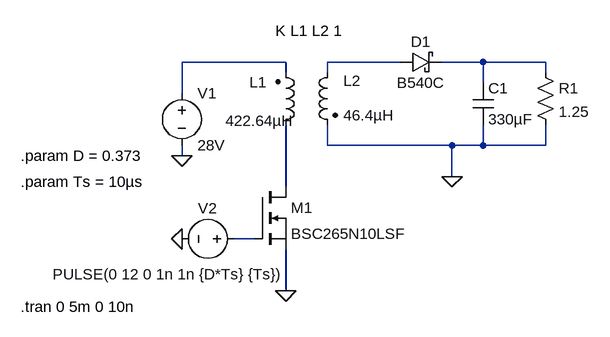
[diagram p0: schematic Flyback_Converter_1st_Draft.asc]
Flyback_Converter_1st_Draft.asc, the LTspice schematic file:
Version 4
SHEET 1 880 680
WIRE 160 64 0 64
WIRE 336 64 224 64
WIRE 464 64 400 64
WIRE 560 64 464 64
WIRE 160 80 160 64
WIRE 224 80 224 64
WIRE 560 80 560 64
WIRE 464 96 464 64
WIRE 0 112 0 64
WIRE 224 192 224 160
WIRE 416 192 224 192
WIRE 464 192 464 160
WIRE 464 192 416 192
WIRE 560 192 560 160
WIRE 560 192 464 192
WIRE 0 208 0 192
WIRE 416 240 416 192
WIRE 160 256 160 160
WIRE 112 336 80 336
WIRE 160 416 160 352
FLAG 0 208 0
FLAG 0 336 0
FLAG 160 416 0
FLAG 416 240 0
SYMBOL voltage 0 96 R0
WINDOW 123 0 0 Left 2
WINDOW 39 0 0 Left 2
SYMATTR InstName V1
SYMATTR Value 28V
SYMBOL ind2 144 176 M180
WINDOW 0 -40 81 Left 2
WINDOW 3 -77 22 Left 2
SYMATTR InstName L1
SYMATTR Value 422.64µH
SYMATTR Type ind
SYMBOL ind2 240 64 M0
WINDOW 0 -36 29 Left 2
WINDOW 3 -87 82 Left 2
SYMATTR InstName L2
SYMATTR Value 46.4µH
SYMATTR Type ind
SYMBOL schottky 336 80 R270
WINDOW 0 32 32 VTop 2
WINDOW 3 0 32 VBottom 2
SYMATTR InstName D1
SYMATTR Value B540C
SYMATTR Description Diode
SYMATTR Type diode
SYMBOL cap 448 96 R0
SYMATTR InstName C1
SYMATTR Value 330µF
SYMBOL nmos 112 256 R0
SYMATTR InstName M1
SYMATTR Value BSC265N10LSF
SYMBOL voltage 96 336 R90
WINDOW 0 -32 56 VBottom 2
WINDOW 3 39 117 VTop 2
WINDOW 123 0 0 Left 2
WINDOW 39 0 0 Left 2
SYMATTR InstName V2
SYMATTR Value PULSE(0 12 0 1n 1n {D*Ts} {Ts})
SYMBOL res 544 64 R0
SYMATTR InstName R1
SYMATTR Value 1.25
TEXT 144 16 Left 2 !K L1 L2 1
TEXT -248 208 Left 2 !.param D = 0.373
TEXT -248 248 Left 2 !.param Ts = 10µs
TEXT -248 440 Left 2 !.tran 0 5m 0 10n

The netlist it stands for:
* Flyback_Converter_1st_Draft.asc
V1 N001 0 28V
L1 N004 N001 422.64µH
L2 N002 0 46.4µH
D1 N002 N003 B540C
C1 N003 0 330µF
M1 N004 N005 0 0 BSC265N10LSF
V2 N005 0 PULSE(0 12 0 1n 1n {D*Ts} {Ts})
R1 N003 0 1.25
.model D D
.lib standard.dio
.model NMOS NMOS
.model PMOS PMOS
.lib standard.mos
K L1 L2 1
.param D = 0.373
.param Ts = 10µs
.tran 0 5m 0 10n
.backanno
.end